# Altium schematic sheet CherryMX.SchDoc
size A4; DrawnBy: Emile Renaud; Revision: V1.0; SheetNumber: 2; SheetTotal: 2
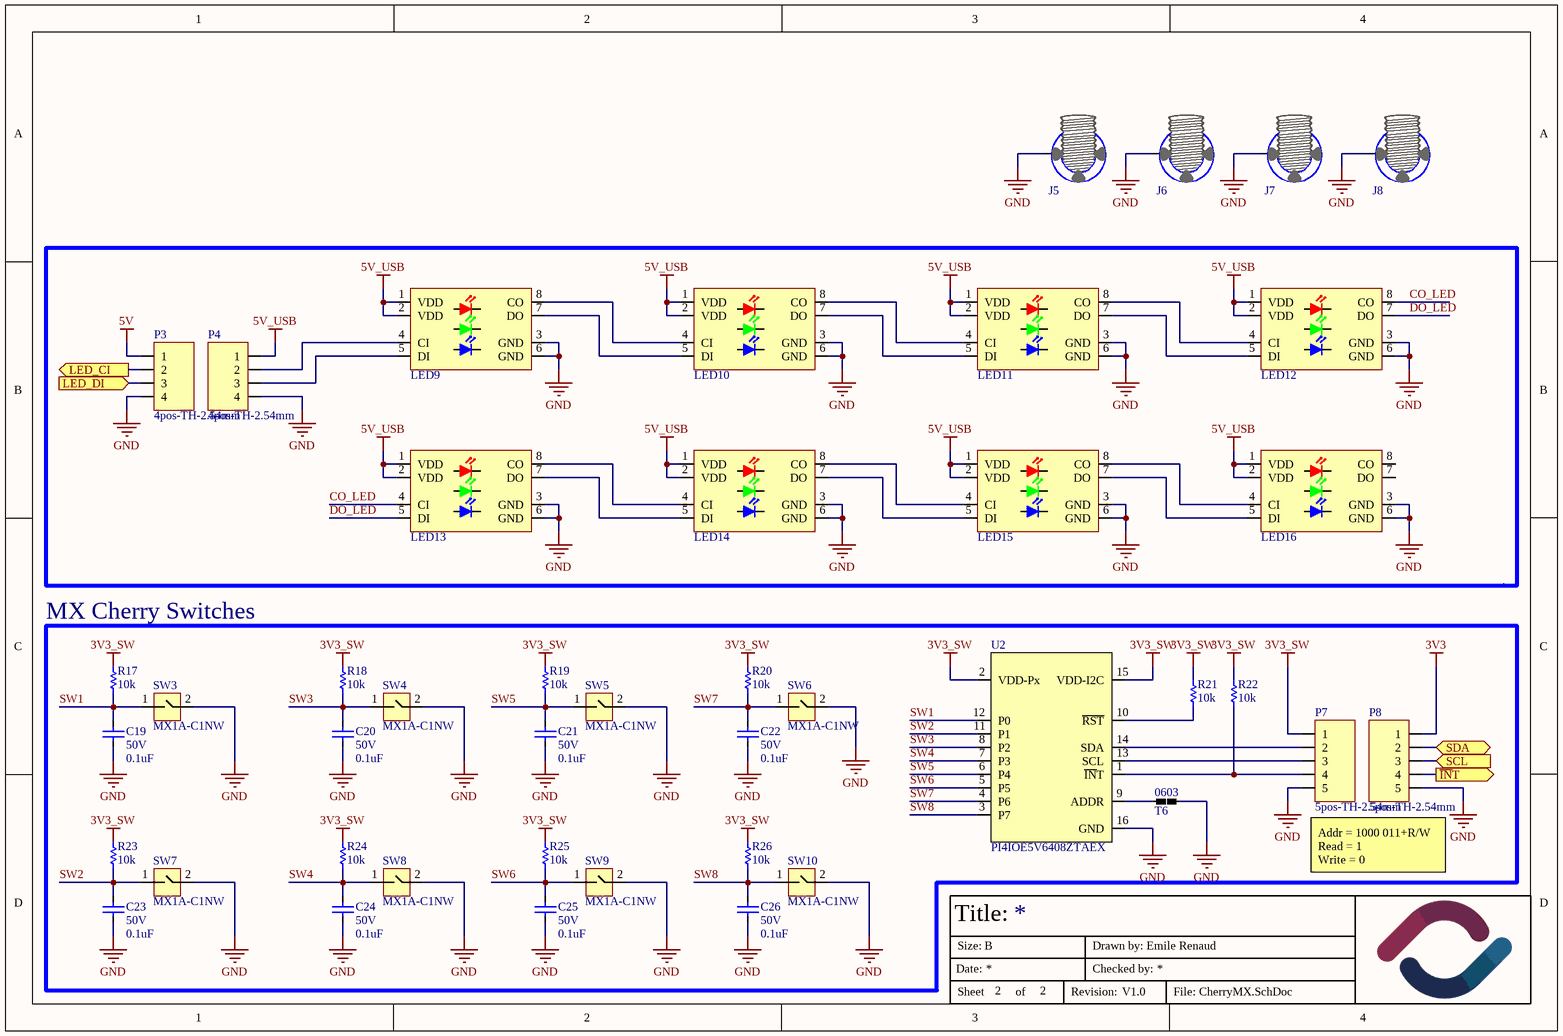
[diagram p0: CherryMX.SchDoc]

## Parts
C19  value 0.1uF  Volt: 50V  [CAPACITOR-0603]  (hidden comment: Capacitor-0603-0.1uF-50V-X7R)
C20  value 0.1uF  Volt: 50V  [CAPACITOR-0603]  (hidden comment: Capacitor-0603-0.1uF-50V-X7R)
C21  value 0.1uF  Volt: 50V  [CAPACITOR-0603]  (hidden comment: Capacitor-0603-0.1uF-50V-X7R)
C22  value 0.1uF  Volt: 50V  [CAPACITOR-0603]  (hidden comment: Capacitor-0603-0.1uF-50V-X7R)
C23  value 0.1uF  Volt: 50V  [CAPACITOR-0603]  (hidden comment: Capacitor-0603-0.1uF-50V-X7R)
C24  value 0.1uF  Volt: 50V  [CAPACITOR-0603]  (hidden comment: Capacitor-0603-0.1uF-50V-X7R)
C25  value 0.1uF  Volt: 50V  [CAPACITOR-0603]  (hidden comment: Capacitor-0603-0.1uF-50V-X7R)
C26  value 0.1uF  Volt: 50V  [CAPACITOR-0603]  (hidden comment: Capacitor-0603-0.1uF-50V-X7R)
J5  hole  [HOLE-M2-Bolt]  (value not drawn)  (no BOM)
J6  hole  [HOLE-M2-Bolt]  (value not drawn)  (no BOM)
J7  hole  [HOLE-M2-Bolt]  (value not drawn)  (no BOM)
J8  hole  [HOLE-M2-Bolt]  (value not drawn)  (no BOM)
LED9  DotStar Micro  [LED_DOTSTAR]  (value not drawn)
LED10  DotStar Micro  [LED_DOTSTAR]  (value not drawn)
LED11  DotStar Micro  [LED_DOTSTAR]  (value not drawn)
LED12  DotStar Micro  [LED_DOTSTAR]  (value not drawn)
LED13  DotStar Micro  [LED_DOTSTAR]  (value not drawn)
LED14  DotStar Micro  [LED_DOTSTAR]  (value not drawn)
LED15  DotStar Micro  [LED_DOTSTAR]  (value not drawn)
LED16  DotStar Micro  [LED_DOTSTAR]  (value not drawn)
P3  4pos-TH-2.54mm  [HDR1X4]
P4  4pos-TH-2.54mm  [HDR1X4]
P7  5pos-TH-2.54mm  [HDR1X5]
P8  5pos-TH-2.54mm  [HDR1X5]
R17  value 10k  [Resistor-0603]  (hidden comment: SMT resistor)
R18  value 10k  [Resistor-0603]  (hidden comment: SMT resistor)
R19  value 10k  [Resistor-0603]  (hidden comment: SMT resistor)
R20  value 10k  [Resistor-0603]  (hidden comment: SMT resistor)
R21  value 10k  [Resistor-0603]  (hidden comment: SMT resistor)
R22  value 10k  [Resistor-0603]  (hidden comment: SMT resistor)
R23  value 10k  [Resistor-0603]  (hidden comment: SMT resistor)
R24  value 10k  [Resistor-0603]  (hidden comment: SMT resistor)
R25  value 10k  [Resistor-0603]  (hidden comment: SMT resistor)
R26  value 10k  [Resistor-0603]  (hidden comment: SMT resistor)
SW3  MX1A-C1NW  [MX2A-G1NB]
SW4  MX1A-C1NW  [MX2A-G1NB]
SW5  MX1A-C1NW  [MX2A-G1NB]
SW6  MX1A-C1NW  [MX2A-G1NB]
SW7  MX1A-C1NW  [MX2A-G1NB]
SW8  MX1A-C1NW  [MX2A-G1NB]
SW9  MX1A-C1NW  [MX2A-G1NB]
SW10  MX1A-C1NW  [MX2A-G1NB]
T6  NetTie_0603  [NetTie-0603-short]  (value not drawn)
U2  PI4IOE5V6408ZTAEX  [UQFN-16]

## Blocks framed on the sheet
MX Cherry Switches: C19-C26 P7 P8 R17-R26 SW3-SW10 T6 U2

## Ports
LED_CI (out), LED_DI (in), SCL (in), SDA (bidir), ~{IN}T (out)

## Nets
3V3: P8.1
3V3_SW: P7.1 R17.2 R18.2 R19.2 R20.2 R21.2 R22.2 R23.2 R24.2 R25.2 R26.2 U2.2(VDD-Px) U2.15(VDD-I2C)
5V: P3.1
5V_USB: LED9.1(VDD) LED9.2(VDD) LED10.1(VDD) LED10.2(VDD) LED11.1(VDD) LED11.2(VDD) LED12.1(VDD) LED12.2(VDD) LED13.1(VDD) LED13.2(VDD) LED14.1(VDD) LED14.2(VDD) LED15.1(VDD) LED15.2(VDD) LED16.1(VDD) LED16.2(VDD) P4.1
GND: C19.1 C20.1 C21.1 C22.1 C23.1 C24.1 C25.1 C26.1 J5.1 J6.1 J7.1 J8.1 LED9.3(GND) LED9.6(GND) LED10.3(GND) LED10.6(GND) LED11.3(GND) LED11.6(GND) LED12.3(GND) LED12.6(GND) LED13.3(GND) LED13.6(GND) LED14.3(GND) LED14.6(GND) LED15.3(GND) LED15.6(GND) LED16.3(GND) LED16.6(GND) P3.4 P4.4 P7.5 P8.5 SW3.2 SW4.2 SW5.2 SW6.2 SW7.2 SW8.2 SW9.2 SW10.2 T6.1 U2.16(GND)
~{IN}T: P8.4 ; port ~{IN}T
CO_LED: LED12.8(CO) LED13.4(CI)
DO_LED: LED12.7(DO) LED13.5(DI)
LED_CI: P3.2 ; port LED_CI
LED_DI: P3.3 ; port LED_DI
SCL: P8.3 ; port SCL
SDA: P8.2 ; port SDA
SW1: C19.2 R17.1 SW3.1 U2.12(P0)
SW2: C23.2 R23.1 SW7.1 U2.11(P1)
SW3: C20.2 R18.1 SW4.1 U2.8(P2)
SW4: C24.2 R24.1 SW8.1 U2.7(P3)
SW5: C21.2 R19.1 SW5.1 U2.6(P4)
SW6: C25.2 R25.1 SW9.1 U2.5(P5)
SW7: C22.2 R20.1 SW6.1 U2.4(P6)
SW8: C26.2 R26.1 SW10.1 U2.3(P7)
NetLED9_4: LED9.4(CI) P4.2
NetLED9_5: LED9.5(DI) P4.3
NetLED9_7: LED9.7(DO) LED10.5(DI)
NetLED9_8: LED9.8(CO) LED10.4(CI)
NetLED10_7: LED10.7(DO) LED11.5(DI)
NetLED10_8: LED10.8(CO) LED11.4(CI)
NetLED11_7: LED11.7(DO) LED12.5(DI)
NetLED11_8: LED11.8(CO) LED12.4(CI)
NetLED13_7: LED13.7(DO) LED14.5(DI)
NetLED13_8: LED13.8(CO) LED14.4(CI)
NetLED14_7: LED14.7(DO) LED15.5(DI)
NetLED14_8: LED14.8(CO) LED15.4(CI)
NetLED15_7: LED15.7(DO) LED16.5(DI)
NetLED15_8: LED15.8(CO) LED16.4(CI)
NetP7_2: P7.2 U2.14(SDA)
NetP7_3: P7.3 U2.13(SCL)
NetP7_4: P7.4 R22.1 U2.1(~{IN}T)
NetR21_1: R21.1 U2.10(~{RST})
NetT6_2: T6.2 U2.9(ADDR)

Not connected (* = marked no-connect by the designer): LED16 7(DO) 8(CO)

## Notes on the sheet
- Addr = 1000 011+R/W
  Read = 1
  Write = 0
- Title:
- Date:
- Size:
- B
- Drawn by:
- Checked by:
- Sheet
- of
- Revision:
- File:
- (in symbol NetTie_0603) 0603

## Library data of the parts
C19-C26 = Capacitor-0603-0.1uF-50V-X7R: Precision: X7R-10%; Package / Case: Metric 1608, EIA 0603; Mounted: Yes; Supplier 1: Digi-Key; Supplier Part Number 1: 1276-1935-2-ND; Supplier 2: Digi-Key; Supplier Part Number 2: 1276-1934-2-ND
J5-J8 = Hole 2.3mm M2: Hole for M2 Bolt with 4mm pad; Mounted: N/A
LED9-LED16 = DotStar Micro: Addressable Lighting - 10 LED Discrete Serial (Shift Register) Red, Green, Blue (RGB) 2.00mm L x 2.00mm W; Package / Case: 4-SMD; Mounted: Yes; Supplier 1: Digi-Key; Supplier Part Number 1: 1528-1826-ND
P3 P4 = 4pos-TH-2.54mm: 4pos TH 2.54mm Header; Supplier 1: Digi-Key; Supplier Part Number 1: N/A; Mounted: Yes; Package / Case: TH; Volt: N/A
P7 P8 = 5pos-TH-2.54mm: 5pos TH 2.54mm Header; Supplier 1: Digi-Key; Supplier Part Number 1: N/A; Mounted: Yes; Package / Case: TH; Volt: N/A
R17-R26 = Resistor0603-10k: Precision: 1%; Watt: 0.1W; Mounted: Yes; Package / Case: Metric 1608, EIA 0603; Supplier 2: Digi-Key; Supplier 4: Digi-Key; Supplier Part Number 2: RMCF0603FT10K0TR-ND; Supplier 1: Digi-Key; Supplier 3: Digi-Key; Supplier Part Number 1: 311-10.0KHRTR-ND
SW3-SW10 = MX1A-C1NW: Pushbutton Switch SPST-NO Keyswitch Through Hole; Volt: 5V; Current: 0.05A; Supplier 1: Digi-Key; Supplier Part Number 1: CH310-ND; Mounted: Yes
U2 = PI4IOE5V6408ZTAEX: I/O Expander 8 I2C 1 MHz 16-UQFN (1.8x2.6); Supplier 1: Digikey; Supplier Part Number 1: PI4IOE5V6408ZTAEXDICT-ND; Package / Case: 16-UQFN; Mounted: Yes; HelpURL: https://www.diodes.com/assets/Datasheets/PI4IOE5V6408.pdf